# Altium schematic sheet SY7201.SchDoc
size A4
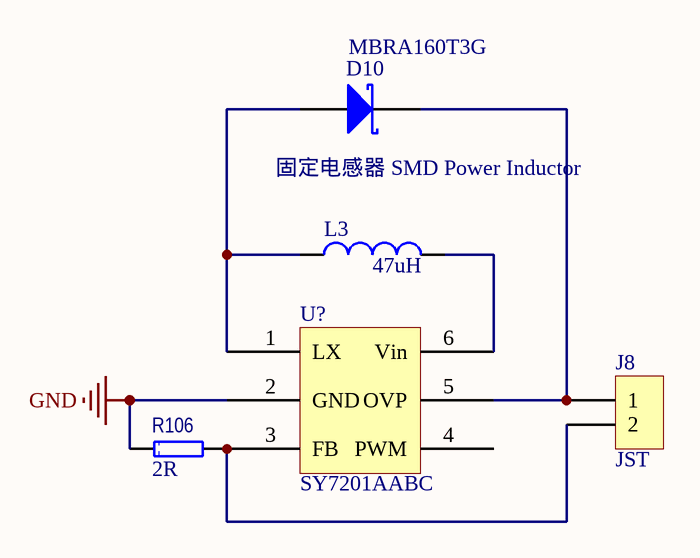
[diagram p0: SY7201.SchDoc]

## Parts
D10  MBRA160T3G  [DO-214AC/SMA]
J8  JST  [JST]
L3  value 47uH  [INDP5050X28N]  (hidden comment: CDRH5D28RH125NP-470MC)
R106  value 2R  [1608[0603]R]  (hidden comment: CRCW06032R00FKEA)
U?  SY7201AABC  [SOT26A-6N]

## Nets
GND: R106.1 U?.2(GND)
NetD10_1: D10.1(A) L3.1 U?.1(LX)
NetD10_2: D10.2(K) J8.1 U?.5(OVP)
NetJ8_2: J8.2 R106.2 U?.3(FB)
NetL3_2: L3.2 U?.6(Vin)

Not connected (* = marked no-connect by the designer): U? 4(PWM)

## Library data of the parts
D10 = 10BQ060: 肖特基二极管与整流器 60 Volt 1.0 A; Manufacturer: ON Semiconductor; Configuration: Single; Forward Continuous Current: 2.1 A; Max Surge Current: 60 A; Forward Voltage Drop: 0.51 V at 1 A; Maximum Reverse Leakage Current: 200 uA; Peak Reverse Voltage: 60 V; Supplier 1: Mouser; Supplier Part Number 1: 863-MBRA160T3G; Manufacturer Part Number: MBRA160T3G; RoHS: RoHS Compliant; Category: Schottky Diodes & Rectifiers; Stock 1: 21130; Pricing 1: 1=0.756, 10=0.502, 100=0.281, 1000=0.211, 5000=0.181, 10000=0.170, 25000=0.155, 50000=0.150, 100000=0.144 (AUD); Operating Temperature Range: - 55 C to + 125 C; Package / Case: SMA; Packaging: Reel; Product: Schottky Diodes; Mounting Style: SMD/SMT; Product Category: Diodes- Schottky; Standard Pack Qty: 5000; RoHS - Mouser: Y; Minimum Order Quantity: 1; Reeling: True; ComponentLink1URL: http://www.mouser.com/ds/2/308/MBRA160T3-D-95572.pdf; ComponentLink1Description: http://www.mouser.com/ds/2/308/MBRA160T3-D-95572.pdf
J8 = CON2: CON
L3 = Inductor: 固定电感器 SMD Power Inductor; Manufacturer: Sumida; 尺寸: 6.2 mm W x 6.3 mm L x 3 mm H; 电感: 47 uH; 最大直流电流: 0.91 A; 最大直流电阻: 500 mOhms; 工作温度范围: - 40 C to + 125 C; 封装: Reel; 产品: SMD Power Inductors; 系列: CDRH; 屏蔽: Shielded; 端接类型: SMD/SMT; 容差: 20 %; 外壳高度: 3 mm; 外壳长度: 6.3 mm; 外壳宽度: 6.2 mm; Product Status: New Product; Supplier 1: Mouser; Supplier Part Number 1: 851-CDRH5D28RH125470; Manufacturer Part Number: CDRH5D28RH125NP-470MC; RoHS: RoHS Compliant; Description 1: 固定电感器 SMD Power Inductor; Category: 固定电感器; Stock 1: 3441; Pricing 1: 1=0.950, 10=0.920, 100=0.650, 500=0.640, 1000=0.620, 2000=0.600, 4000=0.470 (USD); 制造商: Sumida; RoHS - 贸泽: Y; Minimum Order Quantity: 1; Reeling: True; ComponentLink1URL: http://www.mouser.com/ds/2/390/CDRH5D28RH125-4194.pdf; ComponentLink1Description: http://www.mouser.com/ds/2/390/CDRH5D28RH125-4194.pdf
R106 = RES: 厚膜电阻器 - SMD 1/10watt 2ohms 1%; Manufacturer: Vishay / Dale; 尺寸: 0.85 mm W x 1.55 mm L x 0.45 mm H; 工作温度范围: - 55 C to + 155 C; 封装 / 箱体: 0603 (1608 metric); 封装: Reel; 功率额定值: 100 mW; 产品: Thick Film Resistors SMD; 系列: CRCW; 温度系数: 100 PPM / K; 端接类型: SMD/SMT; 电压额定值: 75 V; 外壳代码 - in: 0603; 外壳代码 - mm: 1608; 制造商: Vishay; 产品种类: 0603 Thick Film Chip Resistors; Product Status: New at Mouser; Supplier 1: Mouser; Supplier Part Number 1: 71-CRCW06032R00FKEA; Manufacturer Part Number: CRCW06032R00FKEA; RoHS: RoHS Compliant By Exemption; Category: 厚膜电阻器 - SMD; Stock 1: 9213; Pricing 1: 1=0.080, 10=0.013, 100=0.010, 1000=0.008, 5000=0.005, 25000=0.004, 50000=0.003 (USD); 电阻: 2 Ohms; 容差: 1 %; RoHS - 贸泽: E; Minimum Order Quantity: 1; Reeling: True; ComponentLink1URL: http://www.mouser.com/ds/2/427/dcrcwe3-109170.pdf; ComponentLink1Description: http://www.mouser.com/ds/2/427/dcrcwe3-109170.pdf; Description 1: 厚膜电阻器 - SMD 1/10watt 2ohms 1%
U? = SY7201: 30V High Current Boost LED Driver